# Altium schematic sheet Control.SchDoc: Control Board
size A4; CompanyName: TM; DrawnBy: Juan Tinazzo; SheetNumber: 1; SheetTotal: 7; PageSetup: Record=PageOptions|CenterHorizontal=True|CenterVertical=True|PrintScale=1.20|XCorrection=1.00|YCorrection=1.00|PrintKind=1|BorderSize=5000000|LeftOffset=0|BottomOffset=0|Orientation=2|PaperLength=1000|PaperWidth=1000|Scale=100|PaperSource=7|PrintQuality=-3|MediaType=1|DitherType=10|PrintScaleMode=1|PaperKind=11 x 14 pulg.|PaperIndex=286; Number: CB-DSP
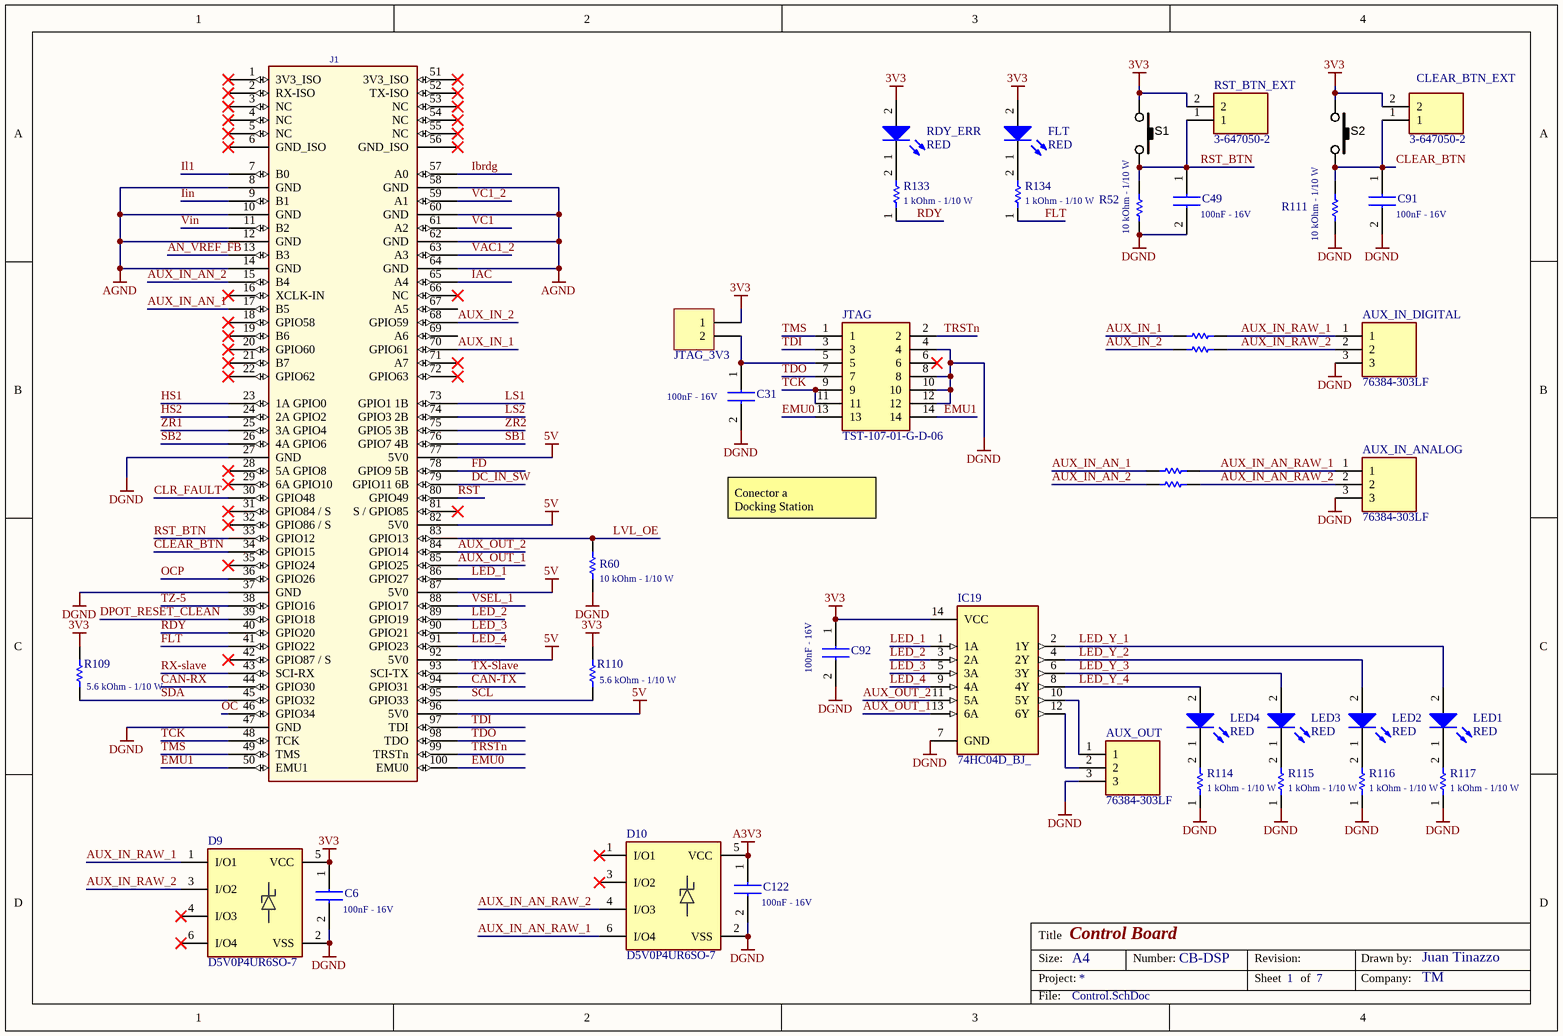
[diagram p0: Control.SchDoc]

## Parts
AUX_IN_ANALOG  76384-303LF  [76384303LF]
AUX_IN_DIGITAL  76384-303LF  [76384303LF]
AUX_OUT  76384-303LF  [76384303LF]
C6  value 100nF - 16V  [CAPC1608X95N]  (hidden comment: 100n 16V 0603)
C31  value 100nF - 16V  [CAPC1608X95N]  (hidden comment: 100n 16V 0603)
C49  value 100nF - 16V  [CAPC1608X95N]  (hidden comment: 100n 16V 0603)
C91  value 100nF - 16V  [CAPC1608X95N]  (hidden comment: 100n 16V 0603)
C92  value 100nF - 16V  [CAPC1608X95N]  (hidden comment: 100n 16V 0603)
C122  value 100nF - 16V  [CAPC1608X95N]  (hidden comment: 100n 16V 0603)
CLEAR_BTN_EXT  3-647050-2  [36470502]
D9  D5V0P4UR6SO-7  [SOT95P285X140-6N]
D10  D5V0P4UR6SO-7  [SOT95P285X140-6N]
FLT  RED  [LEDC1608X80N]
IC19  74HC04D_BJ_  [SOIC127P600X175-14N]
J1  DIM100  [MOLEXDIMM-100-876301001_SD]  (value not drawn)
JTAG  TST-107-01-G-D-06  [TST10701GD06]
JTAG_3V3  Header 2  [HDR1X2]  (value not drawn)
LED1  RED  [LEDC1608X80N]
LED2  RED  [LEDC1608X80N]
LED3  RED  [LEDC1608X80N]
LED4  RED  [LEDC1608X80N]
R52  value 10 kOhm - 1/10 W  [RESC1608X50N]  (hidden comment: CRCW060310K0FKEA)
R60  value 10 kOhm - 1/10 W  [RESC1608X50N]  (hidden comment: CRCW060310K0FKEA)
R68  CRCW060375R0FKEAC  [RESC1608X55N]  (value not drawn)
R73  CRCW060375R0FKEAC  [RESC1608X55N]  (value not drawn)
R105  CRCW060375R0FKEAC  [RESC1608X55N]  (value not drawn)
R109  value 5.6 kOhm - 1/10 W  [RESC1608X50N]  (hidden comment: CRCW06035K60FKEA)
R110  value 5.6 kOhm - 1/10 W  [RESC1608X50N]  (hidden comment: CRCW06035K60FKEA)
R111  value 10 kOhm - 1/10 W  [RESC1608X50N]  (hidden comment: CRCW060310K0FKEA)
R114  value 1 kOhm - 1/10 W  [RESC1608X55N]  (hidden comment: CRCW06031K00FKEAC)
R115  value 1 kOhm - 1/10 W  [RESC1608X55N]  (hidden comment: CRCW06031K00FKEAC)
R116  value 1 kOhm - 1/10 W  [RESC1608X55N]  (hidden comment: CRCW06031K00FKEAC)
R117  value 1 kOhm - 1/10 W  [RESC1608X55N]  (hidden comment: CRCW06031K00FKEAC)
R121  CRCW060375R0FKEAC  [RESC1608X55N]  (value not drawn)
R133  value 1 kOhm - 1/10 W  [RESC1608X55N]  (hidden comment: CRCW06031K00FKEAC)
R134  value 1 kOhm - 1/10 W  [RESC1608X55N]  (hidden comment: CRCW06031K00FKEAC)
RDY_ERR  RED  [LEDC1608X80N]
RST_BTN_EXT  3-647050-2  [36470502]
S1  SW_THT_PB_5.0mm  [TACT_SWITCH_TL-1105-C]  (value not drawn)
S2  SW_THT_PB_5.0mm  [TACT_SWITCH_TL-1105-C]  (value not drawn)

## Nets
3V3: C6.1 C92.1 CLEAR_BTN_EXT.2 D9.5(VCC) FLT.2(A) IC19.14(VCC) JTAG_3V3.1 R109.2 R110.2 RDY_ERR.2(A) RST_BTN_EXT.2 S1.2 S2.2
5V: J1.77(5V0) J1.82(5V0) J1.87(5V0) J1.92(5V0) J1.96(5V0)
A3V3: C122.1 D10.5(VCC)
AGND: J1.8(GND) J1.10(GND) J1.12(GND) J1.14(GND) J1.58(GND) J1.60(GND) J1.62(GND) J1.64(GND)
DGND: AUX_IN_ANALOG.3 AUX_IN_DIGITAL.3 AUX_OUT.3 C6.2 C31.2 C49.2 C91.2 C92.2 C122.2 D9.2(VSS) D10.2(VSS) IC19.7(GND) J1.27(GND) J1.37(GND) J1.47(GND) JTAG.4 JTAG.8 JTAG.10 JTAG.12 R52.1 R60.1 R111.1 R114.1 R115.1 R116.1 R117.1
AN_VREF_FB: J1.13(B3)
AUX_IN_1: J1.70(GPIO61) R68.1
AUX_IN_2: J1.68(GPIO59) R73.1
AUX_IN_AN_1: J1.17(B5) R105.1
AUX_IN_AN_2: J1.15(B4) R121.1
AUX_IN_AN_RAW_1: AUX_IN_ANALOG.1 D10.6(I/O4) R105.2
AUX_IN_AN_RAW_2: AUX_IN_ANALOG.2 D10.4(I/O3) R121.2
AUX_IN_RAW_1: AUX_IN_DIGITAL.1 D9.1(I/O1) R68.2
AUX_IN_RAW_2: AUX_IN_DIGITAL.2 D9.3(I/O2) R73.2
AUX_OUT_1: IC19.13(6A) J1.85(GPIO25)
AUX_OUT_2: IC19.11(5A) J1.84(GPIO14)
CAN-RX: J1.44(GPIO30)
CAN-TX: J1.94(GPIO31)
CLEAR_BTN: C91.1 CLEAR_BTN_EXT.1 J1.34(GPIO15) R111.2 S2.1
CLR_FAULT: J1.30(GPIO48)
DC_IN_SW: J1.79(GPIO11_6B)
DPOT_RESET_CLEAN: J1.39(GPIO18)
EMU0: J1.100(EMU0) JTAG.13
EMU1: J1.50(EMU1) JTAG.14
FD: J1.78(GPIO9_5B)
FLT: J1.41(GPIO22) R134.1
HS1: J1.23(1A_GPIO0)
HS2: J1.24(2A_GPIO2)
IAC: J1.65(A4)
Ibrdg: J1.57(A0)
Iin: J1.9(B1)
Il1: J1.7(B0)
LED_1: IC19.1(1A) J1.86(GPIO27)
LED_2: IC19.3(2A) J1.89(GPIO19)
LED_3: IC19.5(3A) J1.90(GPIO21)
LED_4: IC19.9(4A) J1.91(GPIO23)
LED_Y_1: IC19.2(1Y) LED1.2(A)
LED_Y_2: IC19.4(2Y) LED2.2(A)
LED_Y_3: IC19.6(3Y) LED3.2(A)
LED_Y_4: IC19.8(4Y) LED4.2(A)
LS1: J1.73(GPIO1_1B)
LS2: J1.74(GPIO3_2B)
LVL_OE: J1.83(GPIO13) R60.2
OC: J1.46(GPIO34)
OCP: J1.36(GPIO26)
RDY: J1.40(GPIO20) R133.1
RST: J1.80(GPIO49)
RST_BTN: C49.1 J1.33(GPIO12) R52.2 RST_BTN_EXT.1 S1.1
RX-slave: J1.43(SCI-RX)
SB1: J1.76(GPIO7_4B)
SB2: J1.26(4A_GPIO6)
SCL: J1.95(GPIO33) R110.1
SDA: J1.45(GPIO32) R109.1
TCK: J1.48(TCK) JTAG.9 JTAG.11
TDI: J1.97(TDI) JTAG.3
TDO: J1.98(TDO) JTAG.7
TMS: J1.49(TMS) JTAG.1
TRSTn: J1.99(TRSTn) JTAG.2
TX-Slave: J1.93(SCI-TX)
TZ-5: J1.38(GPIO16)
VAC1_2: J1.63(A3)
VC1: J1.61(A2)
VC1_2: J1.59(A1)
Vin: J1.11(B2)
VSEL_1: J1.88(GPIO17)
ZR1: J1.25(3A_GPIO4)
ZR2: J1.75(GPIO5_3B)
NetAUX_OUT_1: AUX_OUT.1 IC19.10(5Y)
NetAUX_OUT_2: AUX_OUT.2 IC19.12(6Y)
NetC31_1: C31.1 JTAG.5 JTAG_3V3.2
NetFLT_1: FLT.1(K) R134.2
NetLED1_1: LED1.1(K) R117.2
NetLED2_1: LED2.1(K) R116.2
NetLED3_1: LED3.1(K) R115.2
NetLED4_1: LED4.1(K) R114.2
NetR133_2: R133.2 RDY_ERR.1(K)

Not connected (* = marked no-connect by the designer): D9 4(I/O3)* 6(I/O4)*; D10 1(I/O1)* 3(I/O2)*; J1 1(3V3_ISO)* 2(RX-ISO)* 3(NC)* 4(NC)* 5(NC)* 6(GND_ISO)* 16(XCLK-IN)* 18(GPIO58)* 19(B6)* 20(GPIO60)* 21(B7)* 22(GPIO62)* 28(5A_GPIO8)* 29(6A_GPIO10)* 31(GPIO84_/_S)* 32(GPIO86_/_S)* 35(GPIO24)* 42(GPIO87_/_S)* 51(3V3_ISO)* 52(TX-ISO)* 53(NC)* 54(NC)* 55(NC)* 56(GND_ISO)* 66(NC)* 67(A5) 69(A6) 71(A7)* 72(GPIO63)* 81(S_/_GPIO85)*; JTAG 6*

## Notes on the sheet
- Conector a
  Docking Station
- Title
- Size:
- Project:
- A4
- Number:
- Revision:
- Sheet
- of
- Drawn by:
- Company:
- File:

## Library data of the parts
AUX_IN_ANALOG AUX_IN_DIGITAL AUX_OUT = 76384-303LF: Connector; Manufacturer_Name: Amphenol Communications Solutions; Value: Alojamientos de cables y cabecera 3P VERT; Datasheet Link: https://cdn.amphenol-cs.com/media/wysiwyg/files/drawing/76384.pdf; Height: 9.49mm; Manufacturer_Part_Number: 76384-303LF; Mouser Part Number: 649-76384-303LF
  AUX_IN_ANALOG: System: Connector
C6 C31 C49 C91 C92 C122 = EMK107B7104KA-T: Capacitor; Manufacturer_Name: TAIYO YUDEN; Datasheet Link: http://www.farnell.com/datasheets/746258.pdf; Height: 0.95mm; Manufacturer_Part_Number: EMK107B7104KA-T; Mouser Part Number: 963-EMK107B7104KA-T; Mouser Price/Stock: https://www.mouser.co.uk/ProductDetail/Taiyo-Yuden/EMK107B7104KA-T?qs=I6KAKw0tg2ybqzX8hKPgfw%3D%3D; Arrow Part Number: EMK107B7104KA-T; Arrow Price/Stock: https://www.arrow.com/en/products/emk107b7104ka-t/taiyo-yuden
CLEAR_BTN_EXT RST_BTN_EXT = 3-647050-2: Connector; Manufacturer_Name: TE Connectivity; Value: Button; Datasheet Link: https://www.te.com/commerce/DocumentDelivery/DDEController?Action=srchrtrv&DocNm=647050&DocType=Customer+Drawing&DocLang=English&PartCntxt=3-647050-2&DocFormat=pdf; Height: 10.79mm; Manufacturer_Part_Number: 3-647050-2; Mouser Part Number: 571-3-647050-2; Mouser Price/Stock: https://www.mouser.co.uk/ProductDetail/TE-Connectivity-AMP/3-647050-2?qs=W5ux9j661SpBFGFPk8vxRQ%3D%3D; System: Connector
D9 D10 = D5V0P4UR6SO-7: TVS Diode (Uni-directional); Manufacturer_Name: Diodes Inc.; Value: 4CH - Unidireccional - 3.3V - 800mW; Datasheet Link: https://www.arrow.com/en/products/d5v0p4ur6so-7/diodes-incorporated; Height: 1.4mm; Manufacturer_Part_Number: D5V0P4UR6SO-7; Mouser Part Number: 621-D5V0P4UR6SO-7; Mouser Price/Stock: https://www.mouser.co.uk/ProductDetail/Diodes-Incorporated/D5V0P4UR6SO-7?qs=rN85NNvew%2FSjbewGRfhy7A%3D%3D; Arrow Part Number: D5V0P4UR6SO-7; Arrow Price/Stock: https://www.arrow.com/en/products/d5v0p4ur6so-7/diodes-incorporated?region=nac
FLT LED1-LED4 RDY_ERR = 150060RS75000: LED; Manufacturer_Name: Wurth Elektronik; Value: Led Rojo 0603; Datasheet Link: http://katalog.we-online.de/led/datasheet/150060RS75000.pdf; Height: 0.8mm; Manufacturer_Part_Number: 150060RS75000; Mouser Part Number: 710-150060RS75000; Mouser Price/Stock: https://www.mouser.co.uk/ProductDetail/Wurth-Elektronik/150060RS75000?qs=LlUlMxKIyB3QnmZ3fw%2FVCA%3D%3D
IC19 = 74HC04D_BJ_: Integrated Circuit; Manufacturer_Name: Toshiba; Manufacturer_Part_Number: 74HC04D(BJ); Value: Inversores CMOS logic IC series; Datasheet Link: http://toshiba.semicon-storage.com/info/docget.jsp?did=37182&prodName=74HC04D; Height: 1.75mm; Mouser Part Number: 757-74HC04DBJ; Mouser Price/Stock: https://www.mouser.co.uk/ProductDetail/Toshiba/74HC04DBJ?qs=kdd6aVn74hyhHdfHNvZcvA%3D%3D; Arrow Part Number: 74HC04D(BJ); Arrow Price/Stock: https://www.arrow.com/en/products/74hc04d-bj/toshiba?region=europe
J1 = HDR_DIM_100: CONN, 100 pin DIMM socket - Molex 0876301001; Value: Conectores DIMM; Manufacturer_Part_Number: 0876301001
JTAG = TST-107-01-G-D-06: Connector; Manufacturer_Name: SAMTEC; Value: Alojamientos de cables y cabecera Shrouded PCB Headers, 0.100" pitch; Datasheet Link: https://www.arrow.com/en/products/tst-107-01-g-d-06/samtec; Height: 9.27mm; Manufacturer_Part_Number: TST-107-01-G-D-06; Mouser Part Number: 200-TST10701GD06; Mouser Price/Stock: https://www.mouser.co.uk/ProductDetail/Samtec/TST-107-01-G-D-06?qs=rU5fayqh%252BE2aRBN6ChnNCw%3D%3D; Arrow Part Number: TST-107-01-G-D-06; Arrow Price/Stock: https://www.arrow.com/en/products/tst-107-01-g-d-06/samtec?region=nac
JTAG_3V3 = Header 2: Header, 2-Pin; Manufacturer_Part_Number: Header 2.54 mm 2P; Value: Jumper
R52 R60 R111 = CRCW060310K0FKEA: Resistor; Manufacturer_Name: Vishay; Datasheet Link: http://www.vishay.com/docs/20035/dcrcwe3.pdf; Height: 0.5mm; Manufacturer_Part_Number: CRCW060310K0FKEA; Mouser Part Number: 71-CRCW0603-10K-E3; Mouser Price/Stock: https://www.mouser.co.uk/ProductDetail/Vishay-Dale/CRCW060310K0FKEA?qs=pAO1Z172M84BVnhDjtnsoQ%3D%3D; Arrow Part Number: CRCW060310K0FKEA; Arrow Price/Stock: https://www.arrow.com/en/products/crcw060310k0fkea/vishay?region=nac
R68 R73 R105 R121 = CRCW060375R0FKEAC: Resistor; Manufacturer_Name: Vishay; Value: 75 Ohm - 1/10 W; Datasheet Link: https://www.arrow.com/en/products/crcw060375r0fkeac/vishay; Height: 0.55mm; Manufacturer_Part_Number: CRCW060375R0FKEAC; Mouser Part Number: 71-CRCW060375R0FKEAC; Mouser Price/Stock: https://www.mouser.co.uk/ProductDetail/Vishay-Dale/CRCW060375R0FKEAC?qs=E3Y5ESvWgWPOxF9wqCfv4A%3D%3D; Arrow Part Number: CRCW060375R0FKEAC; Arrow Price/Stock: https://www.arrow.com/en/products/crcw060375r0fkeac/vishay?region=nac
R109 R110 = CRCW06035K60FKEA: Resistor; Manufacturer_Name: Vishay; Datasheet Link: http://www.vishay.com/docs/20035/dcrcwe3.pdf; Height: 0.5mm; Manufacturer_Part_Number: CRCW06035K60FKEA; Mouser Part Number: 71-CRCW0603-5.6K-E3; Mouser Price/Stock: https://www.mouser.co.uk/ProductDetail/Vishay-Dale/CRCW06035K60FKEA?qs=%2FAtLfjUBFoX1vHGCl0oHag%3D%3D; Arrow Part Number: CRCW06035K60FKEA; Arrow Price/Stock: https://www.arrow.com/en/products/crcw06035k60fkea/vishay
R114-R117 R133 R134 = CRCW06031K00FKEAC: Resistor; Manufacturer_Name: Vishay; Datasheet Link: https://www.vishay.com/docs/28773/crcwce3.pdf; Height: 0.55mm; Manufacturer_Part_Number: CRCW06031K00FKEAC; Mouser Part Number: 71-CRCW06031K00FKEAC; Mouser Price/Stock: https://www.mouser.co.uk/ProductDetail/Vishay-Dale/CRCW06031K00FKEAC?qs=E3Y5ESvWgWOQ7ePIWbGVFg%3D%3D; Arrow Part Number: CRCW06031K00FKEAC; Arrow Price/Stock: https://www.arrow.com/en/products/crcw06031k00fkeac/vishay?region=nac
S1 S2 = SW_THT_PB_5.0mm: Switch, tact, 5.0mm stem; Manufacturer 1: Wealth Metal; Manufacturer Part Number 1: TC-37XB; Manufacturer_Part_Number: STD Button; Function: On/Off; SCDType: spec; Value: 6.5x6.5mm; 5.0mm stem; Package / Case: 6.5x6.5mm; 5.0mm stem; Material: Brass/Nylon/Ag plating